# Altium schematic sheet Sheet_1_2021-11-20.schdoc
size 307 x 219 mm
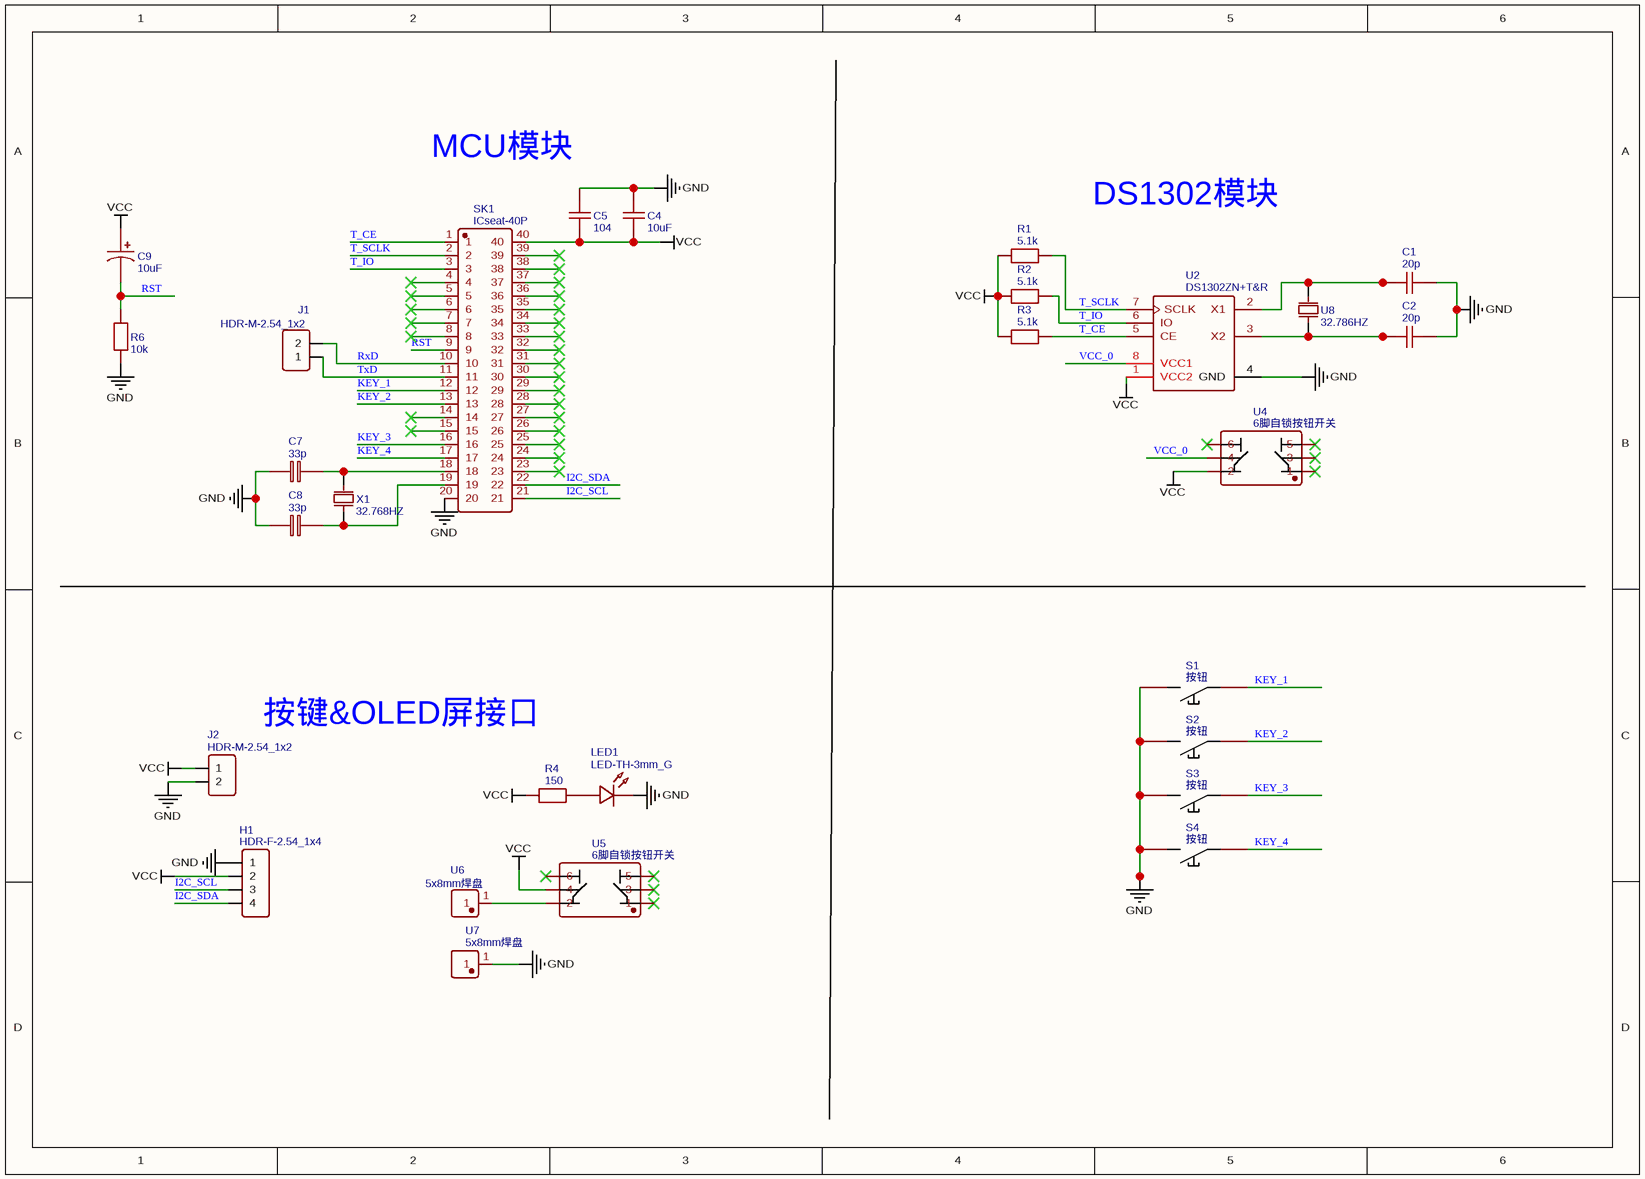
[diagram p0: Sheet_1_2021-11-20.schdoc]

## Parts
C1  20p  [C0805]
C2  20p  [C0805]
C4  10uF  [C0805]
C5  104  [C0805]
C7  33p  [C0805]
C8  33p  [C0805]
C9  10uF  [CASE-A_3216]
H1  HDR-F-2.54_1x4  [HDR-F-2.54_1X4]
J1  HDR-M-2.54_1x2  [HDR-M-2.54_1X2]
J2  HDR-M-2.54_1x2  [HDR-M-2.54_1X2]
LED1  LED-TH-3mm_G  [LED-TH_BD3.0_GREEN]
R1  5.1k  [R0805]
R2  5.1k  [R0805]
R3  5.1k  [R0805]
R4  150  [R0805]
R6  10k  [R0805]
S1  按钮  [按钮]
S2  按钮  [按钮]
S3  按钮  [按钮]
S4  按钮  [按钮]
SK1  ICseat-40P  [DIP-40_L50.8-W17.8-P2.54-LS15.2-BL]
U2  DS1302ZN+T&R  [SOIC-8_L4.9-W3.9-P1.27-LS6.0-BL]
U4  6脚自锁按钮开关  [6脚自锁开关]
U5  6脚自锁按钮开关  [6脚自锁开关]
U6  5x8mm焊盘  [5X8MM焊盘]
U7  5x8mm焊盘  [5X8MM焊盘]
U8  32.786HZ晶振_宽焊盘  [32.786HZ晶振_宽焊盘]  (value not drawn)
X1  32.768HZ  [OSC-TH_L11.1-W4.7-P4.88]

## Nets
GND: C1.2 C2.2 C4.1 C5.1 C7.1 C8.1 H1.1 J2.2 LED1.2 R6.1 S1.4 S2.4 S3.4 S4.4 SK1.20 U2.4(GND) U7.1
VCC: C4.2 C5.2 C9.1 H1.2 J2.1 R1.1 R2.1 R3.1 R4.1 SK1.40 U2.1(VCC2) U4.2 U5.4
I2C_SCL: H1.3 SK1.21
I2C_SDA: H1.4 SK1.22
KEY_1: S1.2 SK1.12
KEY_2: S2.2 SK1.13
KEY_3: S3.2 SK1.16
KEY_4: S4.2 SK1.17
RST: C9.2 R6.2 SK1.9
RxD: J1.2 SK1.10
T_CE: R3.2 SK1.1 U2.5(CE)
T_IO: R2.2 SK1.3 U2.6(IO)
T_SCLK: R1.2 SK1.2 U2.7(SCLK)
TxD: J1.1 SK1.11
VCC_0: U2.8(VCC1) U4.4
NetC1_1: C1.1 U2.2(X1) U8.1(OSC1)
NetC2_1: C2.1 U2.3(X2) U8.2(OSC2)
NetC7_2: C7.2 SK1.18 X1.2(OSC2)
NetC8_2: C8.2 SK1.19 X1.1(OSC1)
NetLED1_1: LED1.1 R4.2
NetU5_2: U5.2 U6.1

Not connected (* = marked no-connect by the designer): SK1 4* 5* 6* 7* 8* 14* 15* 23* 24* 25* 26* 27* 28* 29* 30* 31* 32* 33* 34* 35* 36* 37* 38* 39*; U4 1* 3* 5* 6*; U5 1* 3* 5* 6*

## Notes on the sheet
- MCU模块
- DS1302模块
- 按键&OLED屏接口
- (in symbol 32.786HZ晶振_宽焊盘) 32.786HZ

## Library data of the parts
C1 C2 = 20p: nameAlias: Value(F); Contributor: LCEDA_Lib; spicePre: C; spiceSymbolName: C_0805_US
C4 C9 = 10uF: nameAlias: Value(F); Contributor: LCEDA_Lib; spicePre: C
  C4: spiceSymbolName: C_0805_US
  C9: spiceSymbolName: C_Tan_SMD_A_US
C5 = 104: nameAlias: Value(F); Contributor: LCEDA_Lib; spicePre: C; spiceSymbolName: C_0805_US
C7 C8 = 33p: nameAlias: Value(F); Contributor: LCEDA_Lib; spicePre: C; spiceSymbolName: C_0805_EU
H1 = HDR-F-2.54_1x4: Contributor: LCEDA_Lib; BOM_Supplier Part: C225501; BOM_Supplier: LCSC; spicePre: H; spiceSymbolName: HDR-F-2.54_1x4
J1 J2 = HDR-M-2.54_1x2: Contributor: LCEDA_Lib; BOM_Supplier Part: C124375; BOM_Supplier: LCSC; spicePre: J; spiceSymbolName: HDR-M-2.54_1x2
LED1 = LED-TH-3mm_G: BOM_Manufacturer: EVERLIGHT(台湾亿光); BOM_Manufacturer Part: 204-10SYGD/S530-E3; Contributor: LCEDA_Lib; BOM_Supplier Part: C85161; spicePre: L; spiceSymbolName: LED-TH-3mm_G
R1-R3 = 5.1k: nameAlias: Value(Ω); Contributor: LCEDA_Lib; spicePre: R; spiceSymbolName: R_0805_EU
R4 = 150: nameAlias: Value(Ω); Contributor: LCEDA_Lib; spicePre: R; spiceSymbolName: R_0805_EU
R6 = 10k: nameAlias: Value(Ω); Contributor: LCEDA_Lib; spicePre: R; spiceSymbolName: R_0805_EU
S1-S4 = 按钮: Contributor: lijnu123; spicePre: S; spiceSymbolName: 按钮
SK1 = ICseat-40P: BOM_Manufacturer: BOOMELE; Contributor: LCSC; BOM_Supplier: LCSC; BOM_Manufacturer Part: ICseat-40P; BOM_Supplier Part: C2332; BOM_JLCPCB Part Class: Extended Part; spicePre: S; spiceSymbolName: ICseat-40P
U2 = DS1302ZN+T&R: BOM_Manufacturer: MAXIM; BOM_Supplier: LCSC; BOM_Manufacturer Part: DS1302ZN+T&R; BOM_Supplier Part: C14334; BOM_JLCPCB Part Class: Extended Part; spicePre: U; spiceSymbolName: DS1302ZN+T&amp;amp;R
U4 U5 = 6脚自锁按钮开关: Contributor: haorandad; spicePre: U; spiceSymbolName: 6脚自锁按钮开关
U6 U7 = 5x8mm焊盘: Contributor: jidantou; spicePre: J; spiceSymbolName: 5x8mm焊盘
U8 = 32.786HZ晶振_宽焊盘: Contributor: jidantou; spicePre: U; spiceSymbolName: 32.786HZ晶振_宽焊盘
X1 = 32.768HZ: BOM_Manufacturer: JGHC(晶光华); BOM_Manufacturer Part: 49SAC08000∞2060; Contributor: LCSC; BOM_Supplier: LCSC; BOM_Supplier Part: C443528; BOM_JLCPCB Part Class: Extended Part; spicePre: X; spiceSymbolName: 49SAC08000∞2060